# EAGLE design E-Wuerfel (EAGLE 7.2.0)
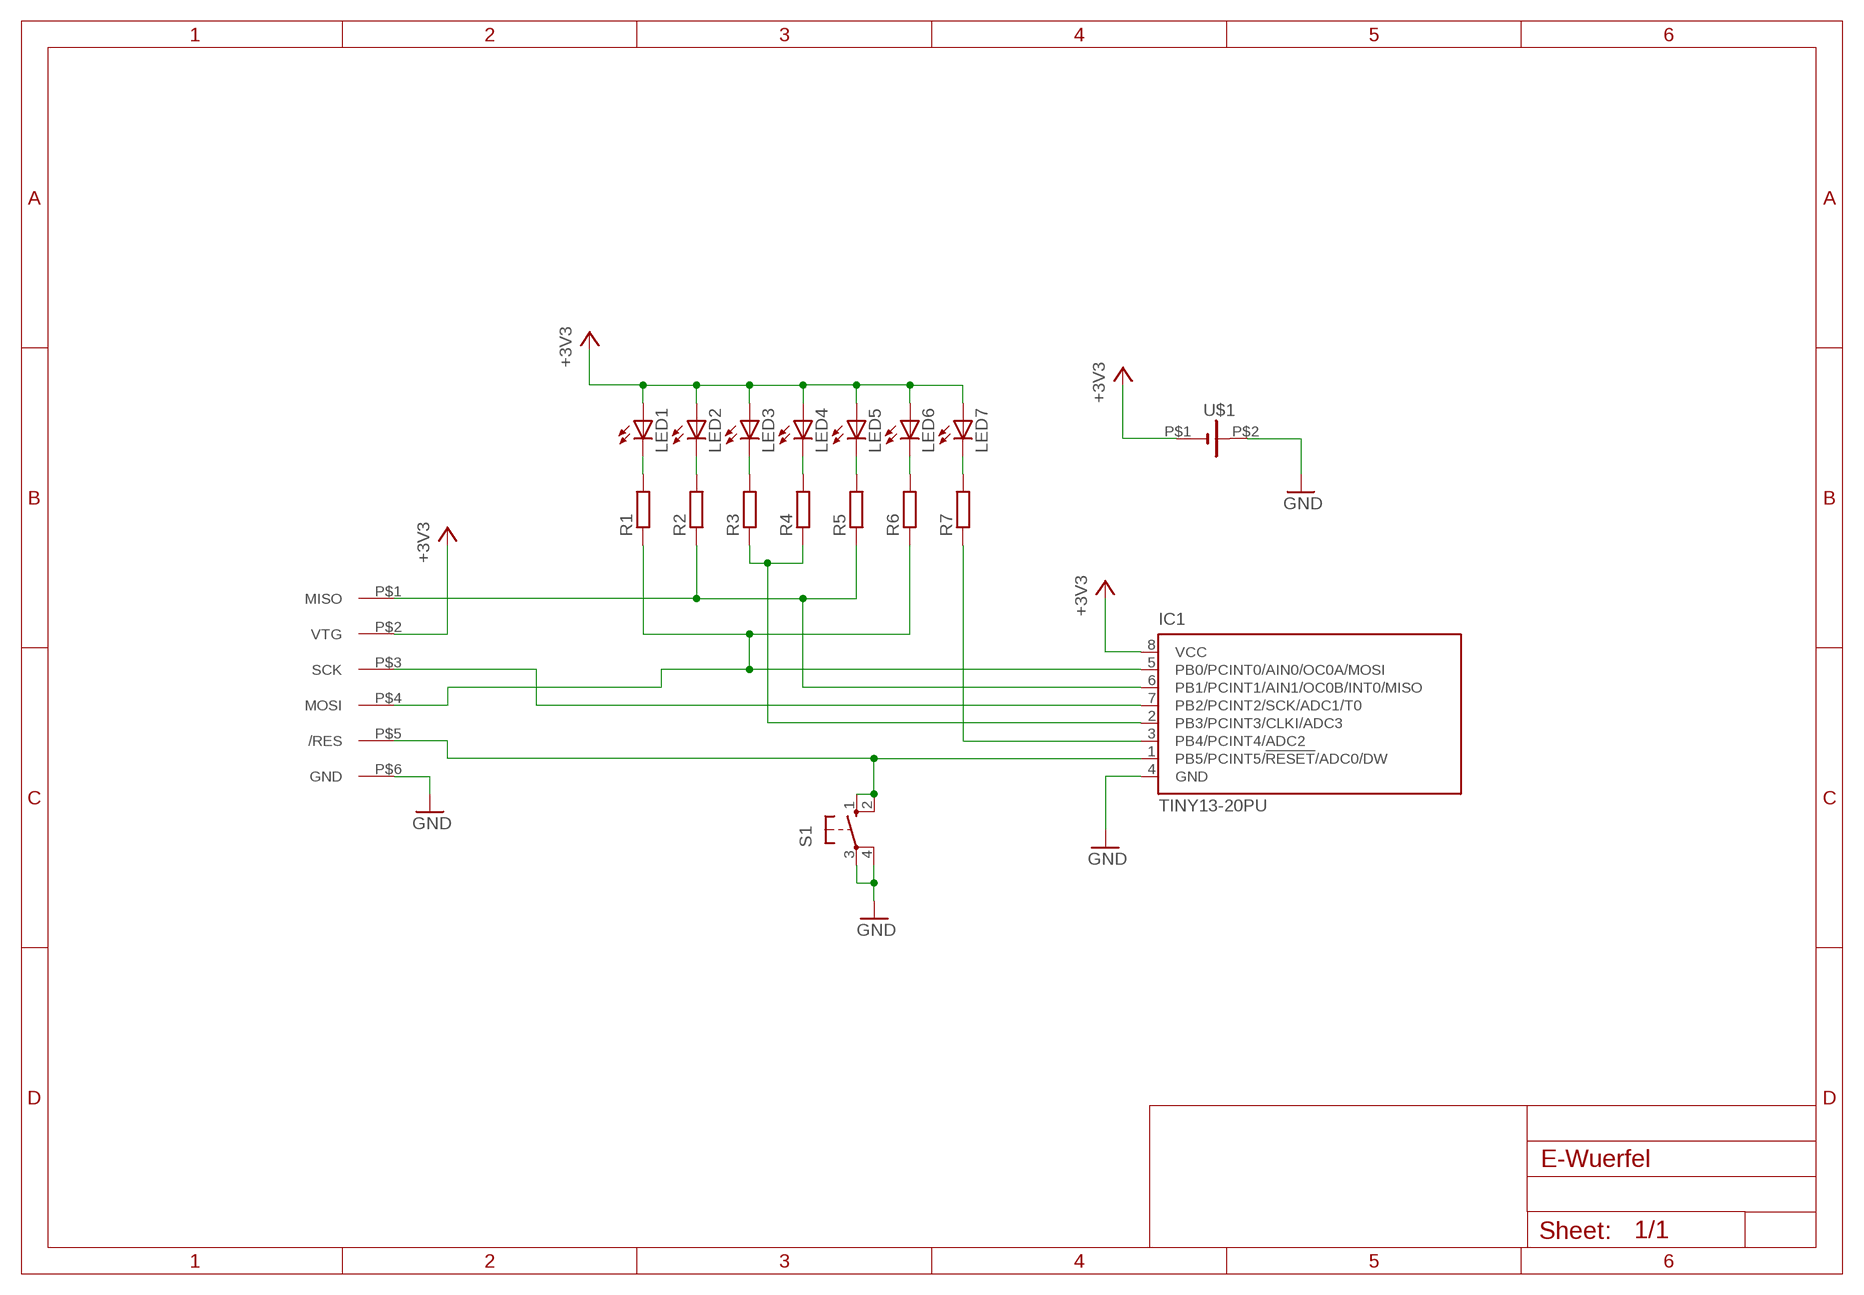
[diagram p0: schematic, sheet 1]

## Parts
IC1  TINY13-20PU  [DIL08]
LED1  LED5MM  [LED5MM]
LED2  LED5MM  [LED5MM]
LED3  LED5MM  [LED5MM]
LED4  LED5MM  [LED5MM]
LED5  LED5MM  [LED5MM]
LED6  LED5MM  [LED5MM]
LED7  LED5MM  [LED5MM]
R1  R-EU_0207/7  [0207/7]
R2  R-EU_0207/7  [0207/7]
R3  R-EU_0207/7  [0207/7]
R4  R-EU_0207/7  [0207/7]
R5  R-EU_0207/7  [0207/7]
R6  R-EU_0207/7  [0207/7]
R7  R-EU_0207/7  [0207/7]
S1  10-XX  [B3F-10XX]
U$1  2XAA  [2AAMOUNT]
U$2  AVRISP1.27  [2X6-127]

## Nets
+3V3: IC1.8(VCC) LED1.A LED2.A LED3.A LED4.A LED5.A LED6.A LED7.A U$1.P$1(-) U$2.P$2(VTG)
GND: IC1.4(GND) S1.3(P) S1.4(P1) U$1.P$2(+) U$2.P$6(GND)
N$1: LED1.K(C) R1.2
N$2: LED2.K(C) R2.2
N$3: LED3.K(C) R3.2
N$4: LED4.K(C) R4.2
N$5: LED5.K(C) R5.2
N$6: LED6.K(C) R6.2
N$7: IC1.5(PB0/PCINT0/AIN0/OC0A/MOSI) R1.1 R6.1 U$2.P$4(MOSI)
N$8: IC1.1(PB5/PCINT5/!RESET!/ADC0/DW) S1.1(S) S1.2(S1) U$2.P$5(/RES)
N$9: IC1.2(PB3/PCINT3/CLKI/ADC3) R3.1 R4.1
N$11: IC1.6(PB1/PCINT1/AIN1/OC0B/INT0/MISO) R2.1 R5.1 U$2.P$1(MISO)
N$12: LED7.K(C) R7.2
N$14: IC1.3(PB4/PCINT4/ADC2) R7.1
N$19: IC1.7(PB2/PCINT2/SCK/ADC1/T0) U$2.P$3(SCK)

## Library data of the parts
IC1 = atmel:TINY13: 8-bit AVR Microcontroller with 1K Bytes In-System Programmable Flash Source: http://www.atmel.com/dyn/resources/prod_documents/2535S.pdf; MPN: ATTINY13-20PU; OC_FARNELL: 9171550; OC_NEWARK: 96K6521
LED1-LED7 = led:LED: LED OSRAM: - CHIPLED LG R971, LG N971, LY N971, LG Q971, LY Q971, LO R971, LY R971 LH N974, LH R974 LS Q976, LO Q976, LY Q976 LO Q996 - Hyper CHIPLED LW Q18S LB Q993, LB Q99A, LB R99A - SideLED LS A670, LO A670, LY A670, LG A670, LP A670 LB A673, LV A673, LT A673, LW A673 LH A674 LY A675 LS A676, LA A676, LO A676, LY A676, LW A676 LS A679, LY A679, LG A679 - Hyper Micro SIDELED® LS Y876, LA Y876, LO Y876, LY Y876 LT Y87S - SmartLED LW L88C, LW L88S LB L89C, LB L89S, LG L890 LS L89K, LO L89K, LY L89K LS L896, LA L896, LO L896, LY L896 - TOPLED LS T670, LO T670, LY T670, LG T670, LP T670 LSG T670, LSP T670, LSY T670, LOP T670, LYG T670 LG T671, LOG T671, LSG T671 LB T673, LV T673, LT T673, LW T673 LH T674 LS T676, LA T676, LO T676, LY T676, LB T676, LH T676, LSB T676, LW T676 LB T67C, LV T67C, LT T67C, LS T67K, LO T67K, LY T67K, LW E67C LS E67B, LA E67B, LO E67B, LY E67B, LB E67C, LV E67C, LT E67C LW T67C LS T679, LY T679, LG T679 LS T770, LO T770, LY T770, LG T770, LP T770 LB T773, LV T773, LT T773, LW T773 LH T774 LS E675, LA E675, LY E675, LS T675 LS T776, LA T776, LO T776, LY T776, LB T776 LHGB T686 LT T68C, LB T68C - Hyper Mini TOPLED® LB M676 - Mini TOPLED Santana® LG M470 LS M47K, LO M47K, LY M47K Source: http://www.osram.convergy.de LUXEON: - LUMILED® LXK2-PW12-R00, LXK2-PW12-S00, LXK2-PW14-U00, LXK2-PW14-V00 LXK2-PM12-R00, LXK2-PM12-S00, LXK2-PM14-U00 LXK2-PE12-Q00, LXK2-PE12-R00, LXK2-PE12-S00, LXK2-PE14-T00, LXK2-PE14-U00 LXK2-PB12-K00, LXK2-PB12-L00, LXK2-PB12-M00, LXK2-PB14-N00, LXK2-PB14-P00, LXK2-PB14-Q00 LXK2-PR12-L00, LXK2-PR12-M00, LXK2-PR14-Q00, LXK2-PR14-R00 LXK2-PD12-Q00, LXK2-PD12-R00, LXK2-PD12-S00 LXK2-PH12-R00, LXK2-PH12-S00 LXK2-PL12-P00, LXK2-PL12-Q00, LXK2-PL12-R00 Source: www.luxeon.com KINGBRIGHT: KA-3528ASYC Source: www.kingbright.com
R1-R7 = rcl:R-EU_: RESISTOR, European symbol
S1 = switch-omron:10-XX: OMRON SWITCH; MPN: B3F-1000; OC_FARNELL: 176432; OC_NEWARK: 36M3542
U$1 = E-dice:2XAA
U$2 = E-dice:AVRISP

## Board
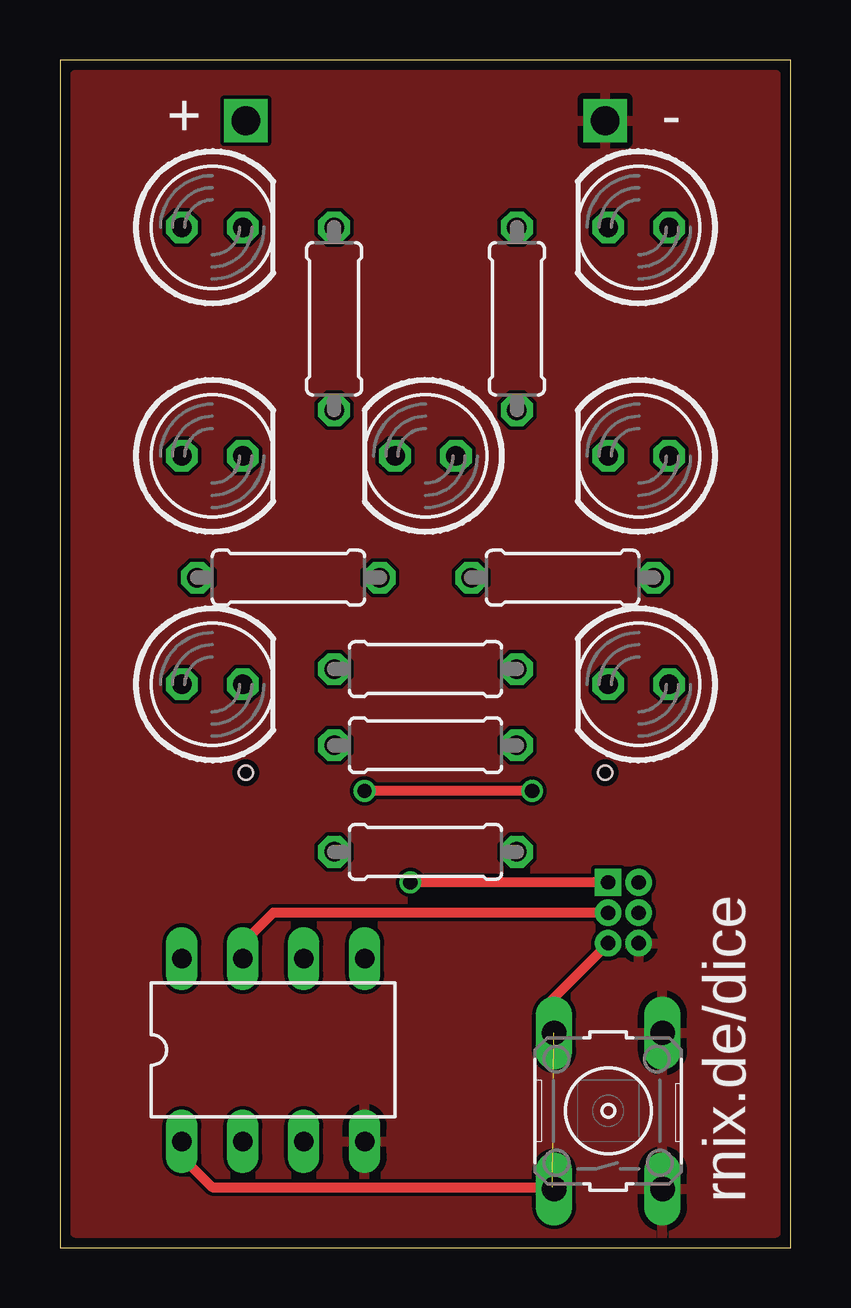
[diagram p1: board, top side]
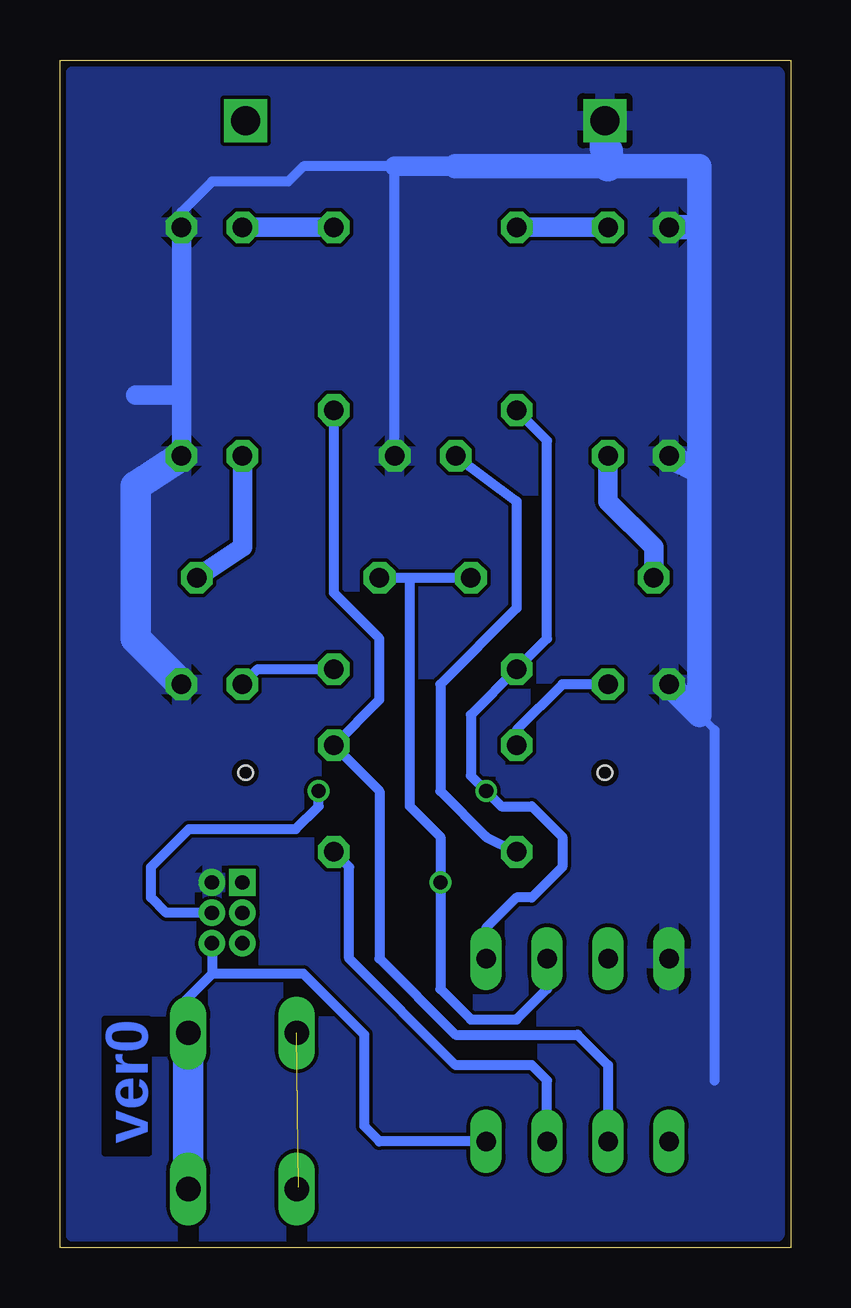
[diagram p2: board, bottom side, seen from below]

Size 30.47 x 49.52 mm. Coordinates in mm from the lower left corner, seen from the top.
Outline: 0,0 30.47,0 30.47,49.52 0,49.52 0,0
Copper layers (1*16): Top 0.035mm / dielectric 1.5mm / Bottom 0.035mm
Design rules "SeeedStudio_2layer_DRU_no_angle_20140221": minimum track width 6mil, minimum drill 12mil, track to track 6mil, track to pad 6mil, pad to pad 6mil, via to via 6mil, smd to smd 0mil, copper to edge 10mil, drill to drill 10mil, minimum pad ring 10mil, minimum via ring 6mil, stop-mask expansion 2mil, vias tented up to drill 100mil, thermal gap 10mil

### Footprints (pad centres in the part's own frame; a part is rotated, then mirrored left to right if it is on the bottom)
DIL08 = drill 0.813 long: 1 -3.81,-3.81; 2 -1.27,-3.81; 3 1.27,-3.81; 4 3.81,-3.81; 5 3.81,3.81; 6 1.27,3.81; 7 -1.27,3.81; 8 -3.81,3.81
LED5MM = drill 0.813 octagon: A -1.27,0; K 1.27,0
0207/7 = drill 0.813 octagon: 1 -3.81,0; 2 3.81,0
B3F-10XX = drill 1.016 long: 1 -3.251,2.261; 2 3.251,2.261; 3 -3.251,-2.261; 4 3.251,-2.261
2AAMOUNT = drill 1.2 square: P$1 7.493,0; P$2 -7.493,0 | hole 0.6: -7.493,27.178; 7.493,27.178
2X6-127 = drill 0.6 pad 0.813 square: P$1 1.27,1.27 | drill 0.6 pad 0.813: P$2 1.27,0; P$3 0,1.27; P$4 0,0; P$5 -1.27,1.27; P$6 -1.27,0

### Placement (x,y rotation side)
IC1  8.89,8.26 0 top
LED1  6.35,42.55 0 top
LED2  6.35,33.02 0 top
LED3  6.35,23.5 0 top
LED4  24.13,42.55 180 top
LED5  24.13,33.02 180 top
LED6  24.13,23.5 180 top
LED7  15.24,33.02 180 top
R1  11.43,38.73 90 top
R2  9.53,27.94 180 top
R3  15.24,20.95 180 top
R4  19.05,38.73 90 top
R5  20.95,27.94 0 top
R6  15.24,24.13 0 top
R7  15.24,16.51 180 top
S1  22.86,5.71 90 top
U$1  15.24,46.99 180 top
U$2  24.13,13.97 90 top

### Tracks (layer width: path | path; a pad name or v marks a point on that pad's centre or on a via)
+3V3
  Bottom 0.305: 3.17,21.59 3.81,22.23
  Bottom 0.406: LED7.A 16.51,45.09 20.32,45.09 20.95,44.45 24.13,44.45 25.4,43.18 | 3.17,6.99 3.17,21.59
  Bottom 0.813: LED4.A 25.4,35.56 | 25.4,35.56 LED5.A | 27.3,35.56 25.4,35.56 | 13.97,45.09 16.51,45.09
  Bottom 1.016: LED1.A 3.81,42.55 | 3.81,42.55 3.81,32.38 | 3.81,32.38 LED2.A | LED3.A 3.81,22.23 3.81,32.38 | 13.97,45.09 7.62,45.09 3.81,45.09 3.81,42.55
  Bottom 1.27: U$1.P$1 7.75,45.85 7.62,45.72 7.62,45.09 | LED6.A 27.3,25.4 27.3,31.75 LED5.A
  pour Bottom: 0.64,0.64 29.84,0.64 29.84,48.9 0.64,48.9
GND
  Bottom 0.406: IC1.4 17.14,4.45 17.78,5.08 17.78,8.89 20.32,11.43 24.13,11.43 | S1.4 25.4,9.25 25.4,10.16 24.13,11.43 | U$2.P$6 24.13,11.43
  Bottom 1.27: S1.3 S1.4
  pour Top: 0.64,0.64 29.84,0.64 29.84,1.27 29.84,48.26 29.84,48.9 0.64,48.9
N$1
  Bottom 0.813: LED1.K R1.2
N$2
  Bottom 0.813: R2.2 5.71,29.21 7.62,31.11 LED2.K
N$3
  Bottom 0.406: LED3.K 9.53,23.5 11.43,21.59 R3.2
N$4
  Bottom 0.813: R4.2 LED4.K
N$5
  Bottom 0.813: LED5.K 22.86,29.21 R5.2
N$6
  Bottom 0.406: LED6.K 22.23,24.13 R6.2
N$7  (via drill 0.6)
  Top 0.406: v19.68,19.05 v12.7,19.05
  Bottom 0.406: R1.1 10.16,33.66 10.16,25.4 R6.1 13.34,22.23 13.34,19.68 v12.7,19.05 12.06,18.41 10.79,18.41 9.53,17.14 9.53,15.88 10.79,14.61 11.43,14.61 12.7,13.34 IC1.5 | U$2.P$4 26.04,13.97 26.67,14.61 26.67,15.88 25.08,17.46 20.64,17.46 19.68,18.41 v19.68,19.05
N$8  (1 unrouted)
  Top 0.406: U$2.P$5 20.32,10.16 20.32,9.25 S1.2 | IC1.1 5.08,3.81 6.35,2.54 20.52,2.54 S1.1
N$9
  Bottom 0.406: R4.1 19.05,27.3 17.14,25.4 17.14,22.86 R3.1 17.14,19.05 17.14,12.06 13.97,8.89 8.89,8.89 7.62,7.62 IC1.2
N$11  (via drill 0.6)
  Top 0.406: U$2.P$1 v14.61,15.24
  Bottom 0.406: R5.1 15.88,27.94 | 15.88,27.94 R2.1 | 15.88,27.94 15.88,18.41 14.61,17.14 v14.61,15.24 14.61,10.79 13.34,9.53 11.43,9.53 10.16,10.79 IC1.6
N$12
  Bottom 0.406: R7.2 12.7,17.14 14.61,19.05 14.61,23.5 11.43,26.67 11.43,31.11 LED7.K
N$14
  Bottom 0.406: IC1.3 10.16,6.99 10.79,7.62 13.97,7.62 18.41,12.06 18.41,15.88 R7.1
N$19
  Top 0.406: U$2.P$3 8.89,13.97 7.62,12.7 IC1.7

### Text on the board
Bottom: ver0
tPlace: + | - | rnix.de/dice